# EAGLE design arm shield design bottom only (EAGLE 7.2.0)
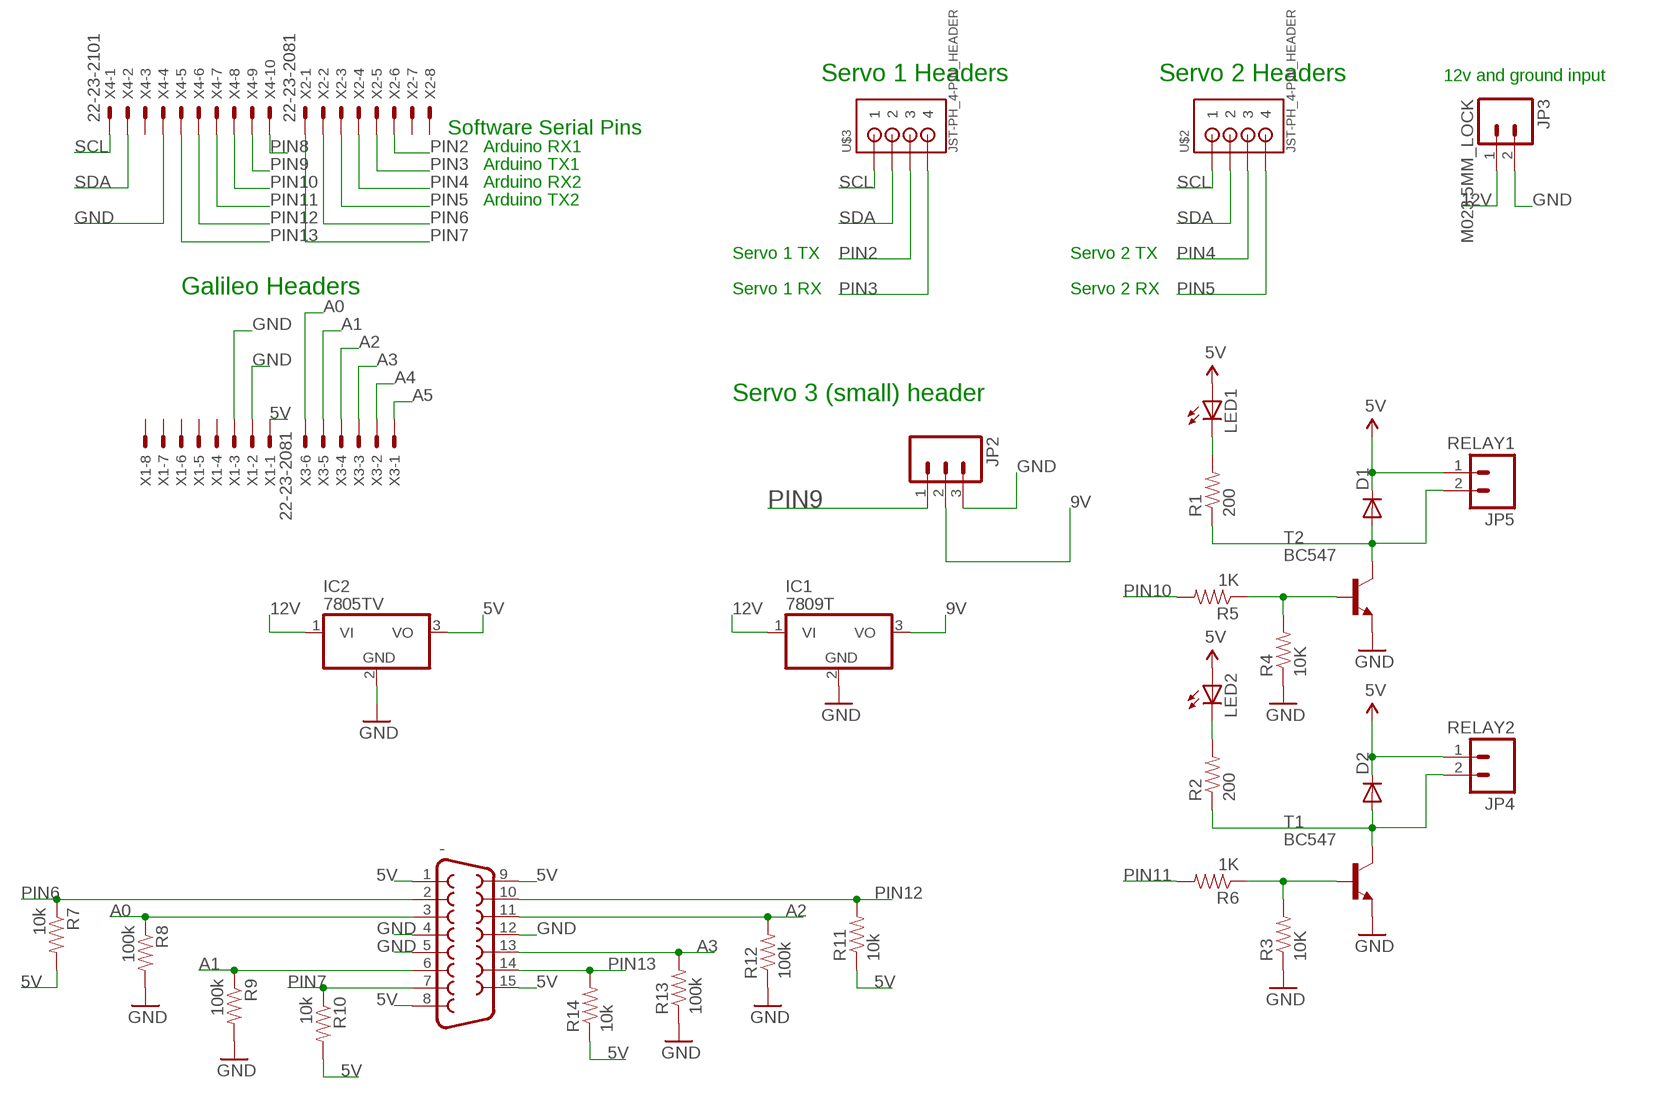
[diagram p0: schematic, sheet 1]

## Parts
-  F15HP  [F15HP]
D1  DIODE1N4148  [DIODE-1N4148]
D2  DIODE1N4148  [DIODE-1N4148]
IC1  7809T  7805TV  [TO220V]
IC2  7805TV  [TO220V]
JP2  M03PTH  [1X03]
JP3  M023.5MM_LOCK  [SCREWTERMINAL-3.5MM-2_LOCK]
JP4  RELAY2  M023.5MM_LOCK  [SCREWTERMINAL-3.5MM-2_LOCK]
JP5  RELAY1  M023.5MM_LOCK  [SCREWTERMINAL-3.5MM-2_LOCK]
LED1  LED3MM  [LED3MM]
LED2  LED3MM  [LED3MM]
R1  200  RESISTORPTH-1/4W-VERT  [AXIAL-0.1]
R2  200  RESISTORPTH-1/4W-VERT  [AXIAL-0.1]
R3  10K  RESISTORPTH-1/4W-VERT  [AXIAL-0.1]
R4  10K  RESISTORPTH-1/4W-VERT  [AXIAL-0.1]
R5  1K  RESISTORPTH-1/4W-VERT  [AXIAL-0.1]
R6  1K  RESISTORPTH-1/4W-VERT  [AXIAL-0.1]
R7  10k  RESISTORPTH-1/4W-VERT  [AXIAL-0.1]
R8  100k  RESISTORPTH-1/4W-VERT  [AXIAL-0.1]
R9  100k  RESISTORPTH-1/4W-VERT  [AXIAL-0.1]
R10  10k  RESISTORPTH-1/4W-VERT  [AXIAL-0.1]
R11  10k  RESISTORPTH-1/4W-VERT  [AXIAL-0.1]
R12  100k  RESISTORPTH-1/4W-VERT  [AXIAL-0.1]
R13  100k  RESISTORPTH-1/4W-VERT  [AXIAL-0.1]
R14  10k  RESISTORPTH-1/4W-VERT  [AXIAL-0.1]
T1  BC547  [TO92]
T2  BC547  [TO92]
U$2  JST-PH_4-PIN_HEADER  [JST_B4B-PH_HEADER]
U$3  JST-PH_4-PIN_HEADER  [JST_B4B-PH_HEADER]
X1  22-23-2081  [22-23-2081]
X2  22-23-2081  [22-23-2081]
X3  22-23-2061  [22-23-2061]
X4  22-23-2101  [22-23-2101]

## Nets
5V: -.1 -.8 -.9 -.15 D1.C D2.C IC2.3(VO) JP4.1 JP5.1 LED1.A LED2.A R7.P$2 R10.P$2 R11.P$1 R14.P$1 X1.1
9V [9VPower]: IC1.3(VO) JP2.2
12V [12VPower]: IC1.1(VI) IC2.1(VI) JP3.1
A0: -.3 R8.P$1 X3.6
A1: -.6 R9.P$1 X3.5
A2: -.11 R12.P$2 X3.4
A3: -.13 R13.P$2 X3.3
A4: X3.2
A5: X3.1
GND [12VPower]: -.4 -.5 -.12 IC1.2(GND) IC2.2(GND) JP2.3 JP3.2 R3.P$1 R4.P$1 R8.P$2 R9.P$2 R12.P$1 R13.P$1 T1.1(E) T2.1(E) X1.2 X1.3 X4.4
N$3: D1.A JP5.2 R1.P$1 T2.3(C)
N$4: D2.A JP4.2 R2.P$1 T1.3(C)
N$5: LED1.K(C) R1.P$2
N$6: R3.P$2 R6.P$1 T1.2(B)
N$7: LED2.K(C) R2.P$2
N$8: R4.P$2 R5.P$1 T2.2(B)
PIN2: U$3.P3 X2.6
PIN3: U$3.P4 X2.5
PIN4: U$2.P3 X2.4
PIN5: U$2.P4 X2.3
PIN6: -.2 R7.P$1 X2.2
PIN7: -.7 R10.P$1 X2.1
PIN8: X4.10
PIN9: JP2.1 X4.9
PIN10: R5.P$2 X4.8
PIN11: R6.P$2 X4.7
PIN12: -.10 R11.P$2 X4.6
PIN13: -.14 R14.P$2 X4.5
SCL: U$2.P1 U$3.P1 X4.1
SDA: U$2.P2 U$3.P2 X4.2
Unconnected: X1.4 X1.5 X1.6 X1.7 X1.8 X2.7 X2.8 X4.3

## Notes on the sheet
- Servo 1 Headers | Servo 2 Headers | 12v and ground input
- Software Serial Pins
- Arduino RX1
- Arduino TX1
- Arduino RX2
- Arduino TX2
- Servo 1 TX | Servo 2 TX
- Galileo Headers | Servo 1 RX | Servo 2 RX
- Servo 3 (small) header

## Library data of the parts
- = con-subd:F15: SUB-D; OC_FARNELL: unknown; OC_NEWARK: unknown
D1 D2 = SparkFun-DiscreteSemi:DIODE: Diode These are standard reverse protection diodes and small signal diodes. SMA package can handle up to about 1A. SOD-323 can handle about 200mA. What the SOD-323 package when ordering, there are some mfgs out there that are 5-pin packages.
IC1 IC2 = linear:78*: Positive VOLTAGE REGULATOR Source: http://cache.national.com/ds/LM/LM78L05.pdf http://www.fairchildsemi.com/ds/LM/LM7805.pdf
JP2 = SparkFun-Connectors:M03: Header 3 Standard 3-pin 0.1" header. Use with straight break away headers (SKU : PRT-00116), right angle break away headers (PRT-00553), swiss pins (PRT-00743), machine pins (PRT-00117), and female headers (PRT-00115). Molex polarized connector foot print use with SKU : PRT-08232 with associated crimp pins and housings.
JP3-JP5 = SparkFun-Connectors:M02: Standard 2-pin 0.1" header. Use with - straight break away headers ( PRT-00116) - right angle break away headers (PRT-00553) - swiss pins (PRT-00743) - machine pins (PRT-00117) - female headers (PRT-00115) Molex polarized connector foot print use with: PRT-08233 with associated crimp pins and housings. 2.54_SCREWTERM for use with PRT-10571. 3.5mm Screw Terminal footprints for PRT-08084 5mm Screw Terminal footprints for use with PRT-08433
LED1 LED2 = SparkFun-LED:LED: LEDs Standard schematic elements and footprints for 5mm, 3mm, 1206, and 0603 sized LEDs. 5mm - Spark Fun Electronics SKU : COM-00529 (and others)
R1-R14 = SparkFun-Resistors:RESISTOR: Resistor Basic schematic elements and footprints for 0603, 1206, and PTH resistors.
T1 T2 = transistor:BC547: NPN TRANSISTOR
U$2 U$3 = SRG:JST-PH_4-PIN_HEADER: 4-pin JST PH Shrouded Header, top entry P/N B4B-PH-K-S Mating connector PHR-4 Mating cable assembly: Sparkfun PRT-09916 <http://www.sparkfun.com/products/9916>; MPN: S4B-PH-K-S(LF)(SN)
X1 X2 = con-molex:22-23-2081: .100" (2.54mm) Center Header - 8 Pin; MF: MOLEX; MPN: 22-23-2081; OC_FARNELL: 1756826; OC_NEWARK: 01C7592
X3 = con-molex:22-23-2061: .100" (2.54mm) Center Header - 6 Pin; MF: MOLEX; MPN: 22-23-2061; OC_FARNELL: 1462922; OC_NEWARK: 27C1933
X4 = con-molex:22-23-2101: .100" (2.54mm) Center Header - 10 Pin; MF: MOLEX; MPN: 22-23-2101; OC_FARNELL: 1756828; OC_NEWARK: 94C0765

## Net classes
0 default: width 1.016 mm
1 12VPower: width 2.032 mm
2 9VPower: width 2.032 mm

## Board
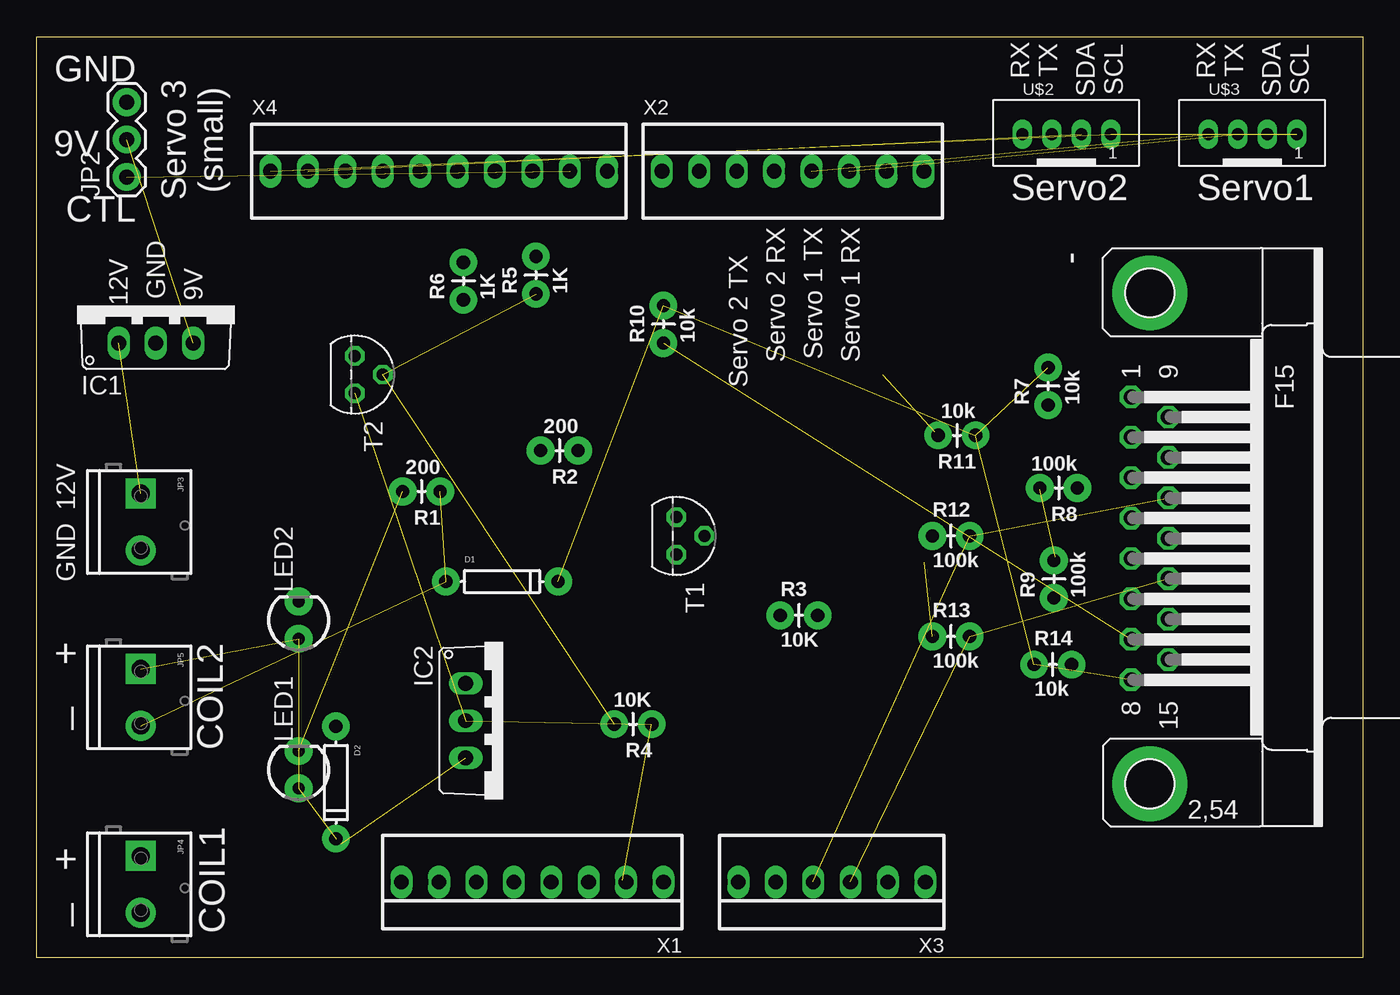
[diagram p1: board, top side]
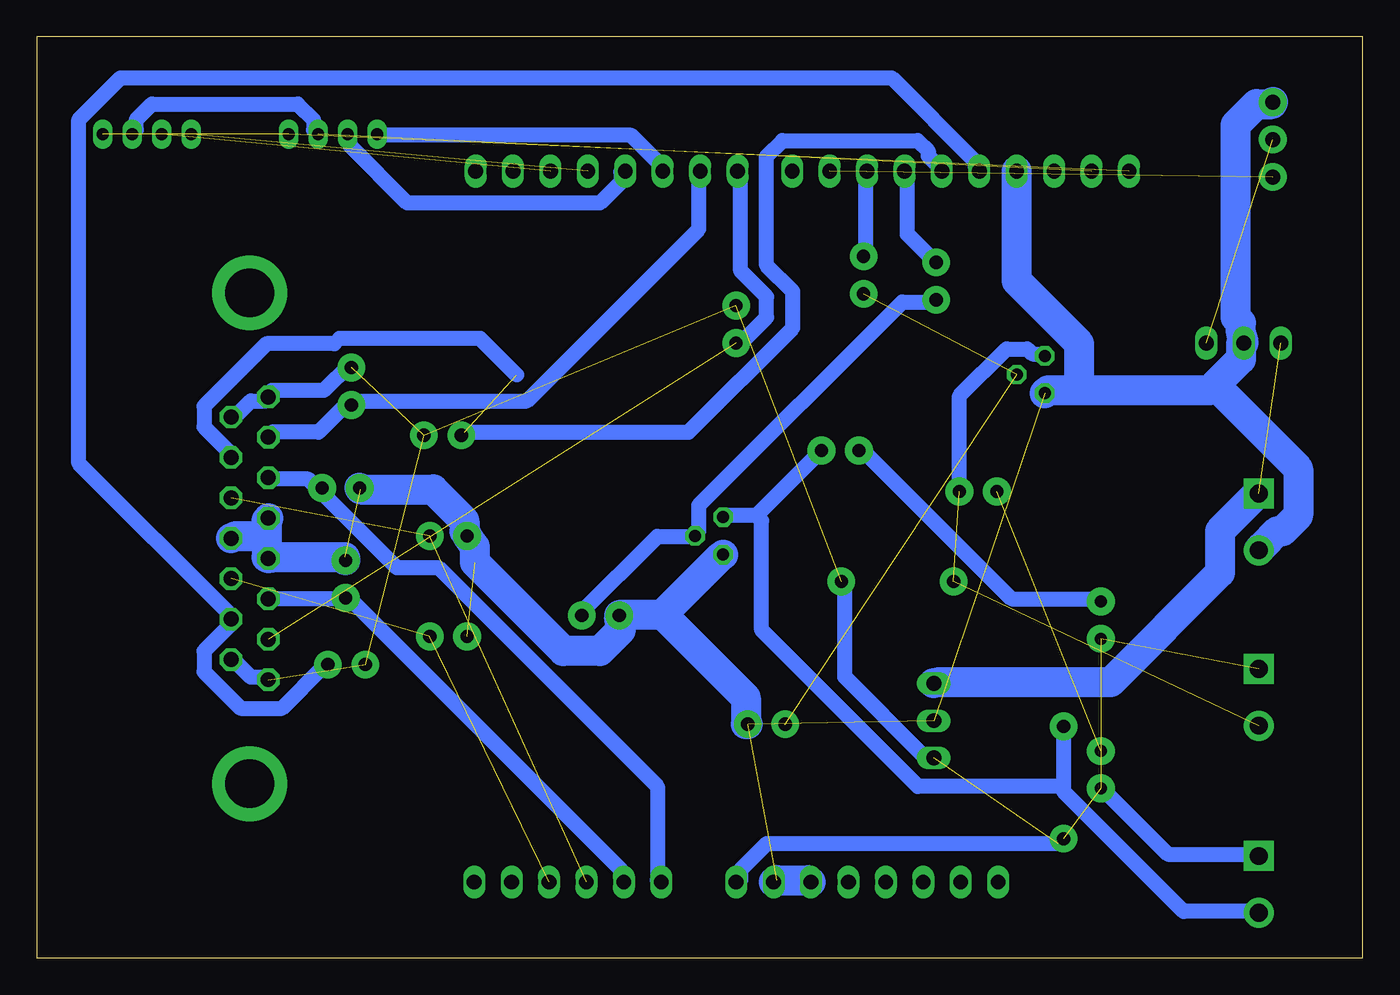
[diagram p2: board, bottom side, seen from below]

Size 90 x 62.54 mm. Coordinates in mm from the lower left corner, seen from the top.
Outline: 90,0 0,0 0,62.54 90,62.54 90,0
Copper layers (1*16): Top 0.035mm / dielectric 1.5mm / Bottom 0.035mm
Design rules "Othermill-DRC-1-64": minimum track width 8mil, minimum drill 0.8mm, track to track 0.39878125mm, track to pad 0.39878125mm, pad to pad 0.39878125mm, via to via 0.39878125mm, smd to smd 0mil, copper to edge 0mil, drill to drill 1mil, minimum pad ring 10mil, minimum via ring 10mil, stop-mask expansion 1mil, vias tented up to drill 30mil, thermal gap 10mil

### Footprints (pad centres in the part's own frame; a part is rotated, then mirrored left to right if it is on the bottom)
F15HP = drill 1.016 octagon: 1 -9.601,-1.27; 2 -6.858,-1.27; 3 -4.115,-1.27; 4 -1.372,-1.27; 5 1.372,-1.27; 6 4.115,-1.27; 7 6.858,-1.27; 8 9.601,-1.27; 9 -8.23,1.27; 10 -5.486,1.27; 11 -2.743,1.27; 12 0,1.27; 13 2.743,1.27; 14 5.486,1.27; 15 8.23,1.27 | drill 3.302 pad 5.08: G1 -16.662,0; G2 16.662,0
DIODE-1N4148 = drill 0.9 pad 1.88: A -3.81,0; C 3.81,0
TO220V = drill 1.016 long: 1 -2.54,-2.54; 2 0,-2.54; 3 2.54,-2.54
1X03 = drill 1.016 pad 1.88: 1 0,0; 2 2.54,0; 3 5.08,0
SCREWTERMINAL-3.5MM-2_LOCK = drill 1.2 pad 2.032 square: 1 -0.178,0 | drill 1.2 pad 2.032: 2 3.678,0
LED3MM = drill 0.813 pad 1.88: A -1.27,0; K 1.27,0
AXIAL-0.1 = drill 0.9 pad 1.88: P$1 0,0; P$2 2.54,0
TO92 = drill 0.813 octagon: 1 1.27,0; 2 0,1.905; 3 -1.27,0
JST_B4B-PH_HEADER = drill 0.8 long: P1 2.98,0.048; P2 0.98,0.048; P3 -1.02,0.048; P4 -3.02,0.048
22-23-2081 = drill 1 long: 1 -8.89,0; 2 -6.35,0; 3 -3.81,0; 4 -1.27,0; 5 1.27,0; 6 3.81,0; 7 6.35,0; 8 8.89,0
22-23-2061 = drill 1 long: 1 -6.35,0; 2 -3.81,0; 3 -1.27,0; 4 1.27,0; 5 3.81,0; 6 6.35,0
22-23-2101 = drill 1 long: 1 -11.43,0; 2 -8.89,0; 3 -6.35,0; 4 -3.81,0; 5 -1.27,0; 6 1.27,0; 7 3.81,0; 8 6.35,0; 9 8.89,0; 10 11.43,0

### Placement (x,y rotation side)
-  75.55,28.5 270 top
D1  31.58,25.56 0 top
D2  20.31,11.91 270 top
IC1  8.08,44.29 0 top
IC2  31.66,16.11 270 top
JP2  6.1,53.02 90 top
JP3  7.05,31.35 270 top
JP4  7.05,6.75 270 top
JP5  7.05,19.45 270 top
LED1  17.77,12.78 90 top
LED2  17.77,22.94 90 top
R1  27.37,31.67 180 top
R2  36.74,34.45 180 top
R3  50.47,23.26 0 top
R4  41.74,15.88 180 top
R5  33.88,45.09 90 top
R6  28.96,44.69 90 top
R7  68.65,37.54 90 top
R8  70.63,31.91 180 top
R9  69.04,24.45 90 top
R10  42.53,41.75 90 top
R11  63.73,35.48 180 top
R12  60.79,28.65 0 top
R13  60.79,21.83 0 top
R14  67.69,19.92 0 top
T1  43.41,28.65 270 top
T2  21.58,39.61 270 top
U$2  69.92,55.88 0 top
U$3  82.54,55.88 0 top
X1  33.64,5.16 180 top
X2  51.32,53.42 0 top
X3  53.96,5.16 180 top
X4  27.29,53.42 0 top

### Tracks (layer width: path | path; a pad name or v marks a point on that pad's centre or on a via)
5V  (9 unrouted)
  Bottom 1.016: -.9 76.53,36.76 75.47,37.82 74.41,37.82 -.1 74.05,38.53 70.52,38.53 68.75,40.29 R7.P$2 | -.8 74.41,19.07 75.47,19.07 76.53,20.13 -.15 | X1.1 42.22,5.28 42.22,5.99 40.45,7.75 20.65,7.75 D2.C | D1.C 35.15,25.44 35.15,19.07 29.84,13.77 29.14,13.77 IC2.3 | JP4.1 7.21,7.05 13.22,7.05 17.46,11.29 LED1.A
9V  (1 unrouted)
12V  (1 unrouted)
  Bottom 2.032: IC2.1 28.78,18.72 17.11,18.72 9.68,26.15 9.68,28.98 7.21,31.45 JP3.1
A0
  Bottom 1.016: X3.6 47.88,5.28 47.88,11.64 62.74,26.5 65.57,26.5 70.87,31.81 R8.P$1 71.23,32.16 71.58,32.51 74.05,32.51 -.3
A1
  Bottom 1.016: X3.5 50.36,5.28 50.36,5.99 68.75,24.38 R9.P$1 69.46,24.38 74.05,24.38 -.6
A2  (2 unrouted)
A3  (2 unrouted)
GND  (5 unrouted)
  Bottom 2.032: 19.23,38.53 10.39,38.53 10.04,38.88 | 19.23,38.53 21.35,38.53 T2.1 | 10.04,38.88 8.27,40.65 8.27,41.71 IC1.2 8.27,42.42 8.27,43.12 8.62,43.48 8.62,56.56 7.21,57.98 6.15,57.98 JP2.3 | 19.23,38.53 19.23,41.71 23.48,45.95 23.48,53.38 X4.4 | 10.04,38.88 4.38,33.22 4.38,30.04 5.44,28.98 5.79,28.98 6.85,27.91 JP3.2 | X1.3 37.62,5.28 39.75,5.28 X1.2 | 74.41,28.62 74.41,29.68 -.4 | 74.41,28.62 74.41,27.21 -.5 73.35,27.21 69.1,27.21 R9.P$2 | 74.41,28.62 76.53,28.62 -.12 | R8.P$2 68.04,31.81 63.09,31.81 60.97,29.68 60.97,28.98 R12.P$1 60.26,27.91 60.26,26.85 54.25,20.84 51.77,20.84 50.36,22.26 R3.P$1 50.36,23.32 47.53,23.32 | 47.53,23.32 43.64,27.21 T1.1 | 47.53,23.32 41.87,17.66 41.87,15.89 R4.P$1
N$3  (2 unrouted)
  Bottom 1.016: T2.3 21.71,41 22.42,41 22.77,41.35 24.18,41.35 27.37,38.17 27.37,31.81 R1.P$1
N$4
  Bottom 1.016: 41.16,30.04 43.28,30.04 T1.3 | 41.16,30.04 36.92,34.28 R2.P$1 | 20.29,11.64 20.29,11.29 12.16,3.16 7.21,3.16 JP4.2 | 20.29,11.64 20.29,15.54 D2.A | 20.29,11.64 30.2,11.64 40.81,22.26 40.81,29.68 41.16,30.04
N$5  (1 unrouted)
N$6
  Bottom 1.016: R3.P$2 53.19,23.32 47.88,28.62 45.41,28.62 T1.2 45.05,28.98 45.05,30.75 31.26,44.54 29.14,44.54 R6.P$1
N$7
  Bottom 1.016: LED2.K 17.82,24.38 23.83,24.38 34.09,34.63 R2.P$2
N$8  (2 unrouted)
PIN2  (1 unrouted)
PIN3  (1 unrouted)
PIN4
  Bottom 1.016: U$2.P3 68.75,55.86 68.75,55.15 64.86,51.26 51.77,51.26 50.36,52.67 50.36,53.38 X2.4
PIN5
  Bottom 1.016: U$2.P4 66.63,55.86 49.65,55.86 47.53,53.73 X2.3
PIN6
  Bottom 1.016: X2.2 45.05,53.38 45.05,49.49 56.72,37.82 68.4,37.82 R7.P$1 69.1,37.47 70.87,35.7 74.05,35.7 -.2
PIN7  (1 unrouted)
  Bottom 1.016: X2.1 42.22,53.38 42.22,46.66 40.45,44.89 40.45,43.48 42.22,41.71 R10.P$1
PIN9  (1 unrouted)
PIN10
  Bottom 1.016: X4.8 33.73,53.38 33.73,47.72 R5.P$2
PIN11
  Bottom 1.016: X4.7 30.9,53.38 30.9,49.14 29.14,47.37 R6.P$2
PIN12  (1 unrouted)
  Bottom 1.016: X4.6 28.78,53.73 29.49,54.44 29.49,54.8 30.2,55.5 39.39,55.5 40.45,54.44 40.45,47.02 38.69,45.25 38.69,42.77 45.76,35.7 60.97,35.7 R11.P$2 | 57.43,39.59 59.91,42.06 69.46,42.06 69.81,41.71 74.41,41.71 78.65,37.47 78.65,36.05 76.88,34.28 -.10
PIN13
  Bottom 1.016: X4.5 26.31,53.73 26.31,54.09 31.97,59.75 84.31,59.75 87.14,56.92 87.14,33.57 76.88,23.32 -.14 76.88,22.61 78.65,20.84 78.65,19.43 76.18,16.95 73.35,16.95 70.52,19.78 R14.P$2
SCL  (2 unrouted)
SDA  (1 unrouted)
  Bottom 1.016: U$2.P2 71.23,56.21 71.23,56.92 72.29,57.98 82.19,57.98 83.25,56.92 83.25,56.21 U$3.P2

### Text on the board
tNames: GND | RX | TX | RX | TX | SDA | SCL | SDA | SCL | 9V | Servo 3 / (small) | CTL | Servo2 | Servo1 | Servo 2 RX | Servo 1 TX | Servo 1 RX | GND | Servo 2 TX | 12V | 9V | 12V | GND | + | COIL2 | _ | + | _ | COIL1